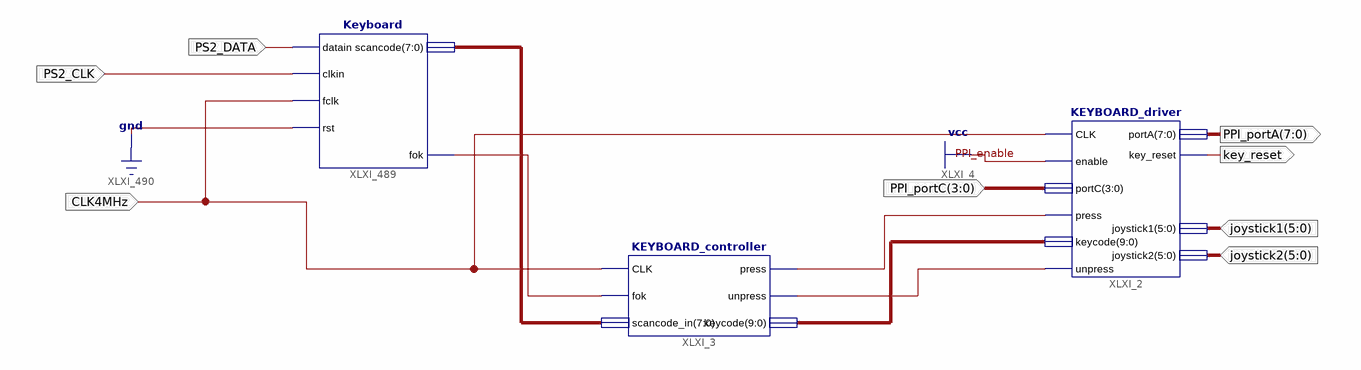
[diagram p0: schematic sheet 1]
// Xilinx ISE schematic joykeyb.sch (artix7) as structural Verilog: 3 symbols, 8 ports
module joykeyb (
  input  CLK4MHz,
  input  [3:0] PPI_portC,
  input  [5:0] joystick1,
  input  [5:0] joystick2,
  input  PS2_DATA,
  input  PS2_CLK,
  output [7:0] PPI_portA,
  output key_reset
);

  wire XLXN_30, XLXN_31, XLXN_57;
  wire [7:0] XLXN_29;
  wire [9:0] XLXN_27;

  KEYBOARD_controller XLXI_3 (
    .CLK(CLK4MHz), .fok(XLXN_57), .scancode_in(XLXN_29), .press(XLXN_30), .unpress(XLXN_31), .keycode(XLXN_27));
  KEYBOARD_driver XLXI_2 (
    .CLK(CLK4MHz), .enable(1'b1), .press(XLXN_30), .unpress(XLXN_31), .portC(PPI_portC),
    .joystick1(joystick1), .joystick2(joystick2), .keycode(XLXN_27), .key_reset(key_reset), .portA(PPI_portA));
  Keyboard XLXI_489 (.datain(PS2_DATA), .clkin(PS2_CLK), .fclk(CLK4MHz), .rst(1'b0), .fok(XLXN_57), .scancode(XLXN_29));
endmodule
